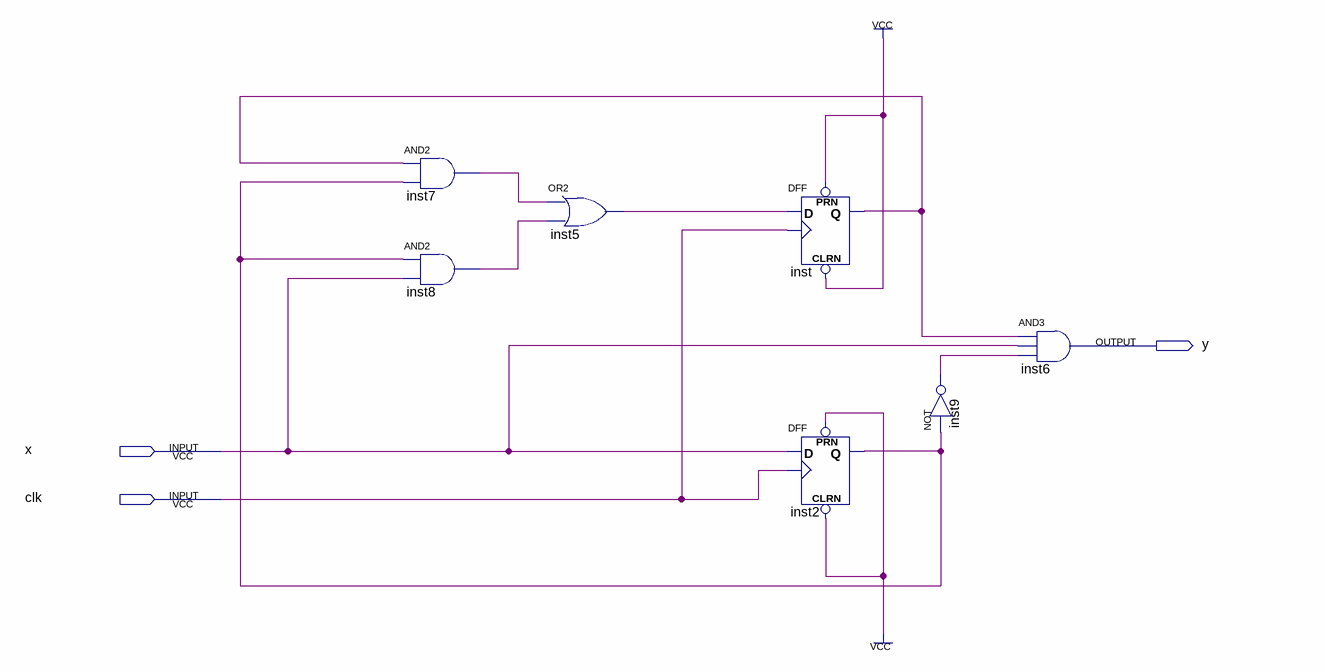
[diagram p0: schematic sheet]
// Quartus schematic SeqDet1101.bdf as structural Verilog: 7 symbols, 3 pins
module SeqDet1101 (
  input  x,
  input  clk,
  output y
);

  wire inst2_q, inst5_out, inst7_out, inst8_out, inst9_out, inst_q;

  and inst7 (inst7_out, inst_q, inst2_q);
  and inst8 (inst8_out, inst2_q, x);
  or inst5 (inst5_out, inst7_out, inst8_out);
  DFF inst (.CLRN(1'b1), .CLK(clk), .D(inst5_out), .PRN(1'b1), .Q(inst_q));
  DFF inst2 (.CLRN(1'b1), .CLK(clk), .D(x), .PRN(1'b1), .Q(inst2_q));
  not inst9 (inst9_out, inst2_q);
  and inst6 (y, inst_q, x, inst9_out);
endmodule
